# Altium schematic sheet DS1302.SchDoc
size A4
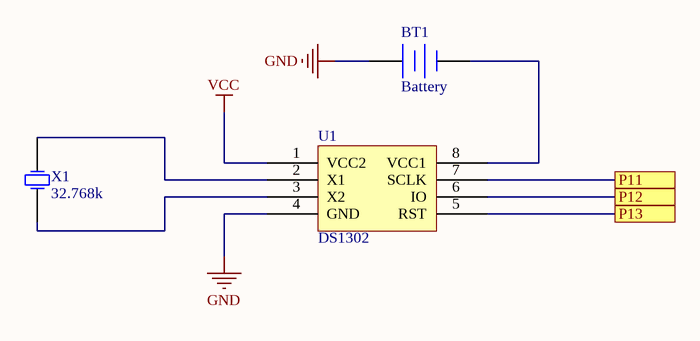
[diagram p0: DS1302.SchDoc]

## Parts
BT1  Battery  [BT]
U1  DS1302  [DIP8]
X1  32.768k  [XTAL2]

## Ports
P11, P12, P13

## Nets
GND: BT1.1(+) U1.4(GND)
VCC: U1.1(VCC2)
P11: U1.7(SCLK) ; port P11
P12: U1.6(IO) ; port P12
P13: U1.5(RST) ; port P13
NetBT1_2: BT1.2(-) U1.8(VCC1)
NetU1_2: U1.2(X1) X1.2(OSC2)
NetU1_3: U1.3(X2) X1.1(OSC1)

## Library data of the parts
X1 = XTAL_2